# EAGLE design Power Monitor (EAGLE 7.7.0)
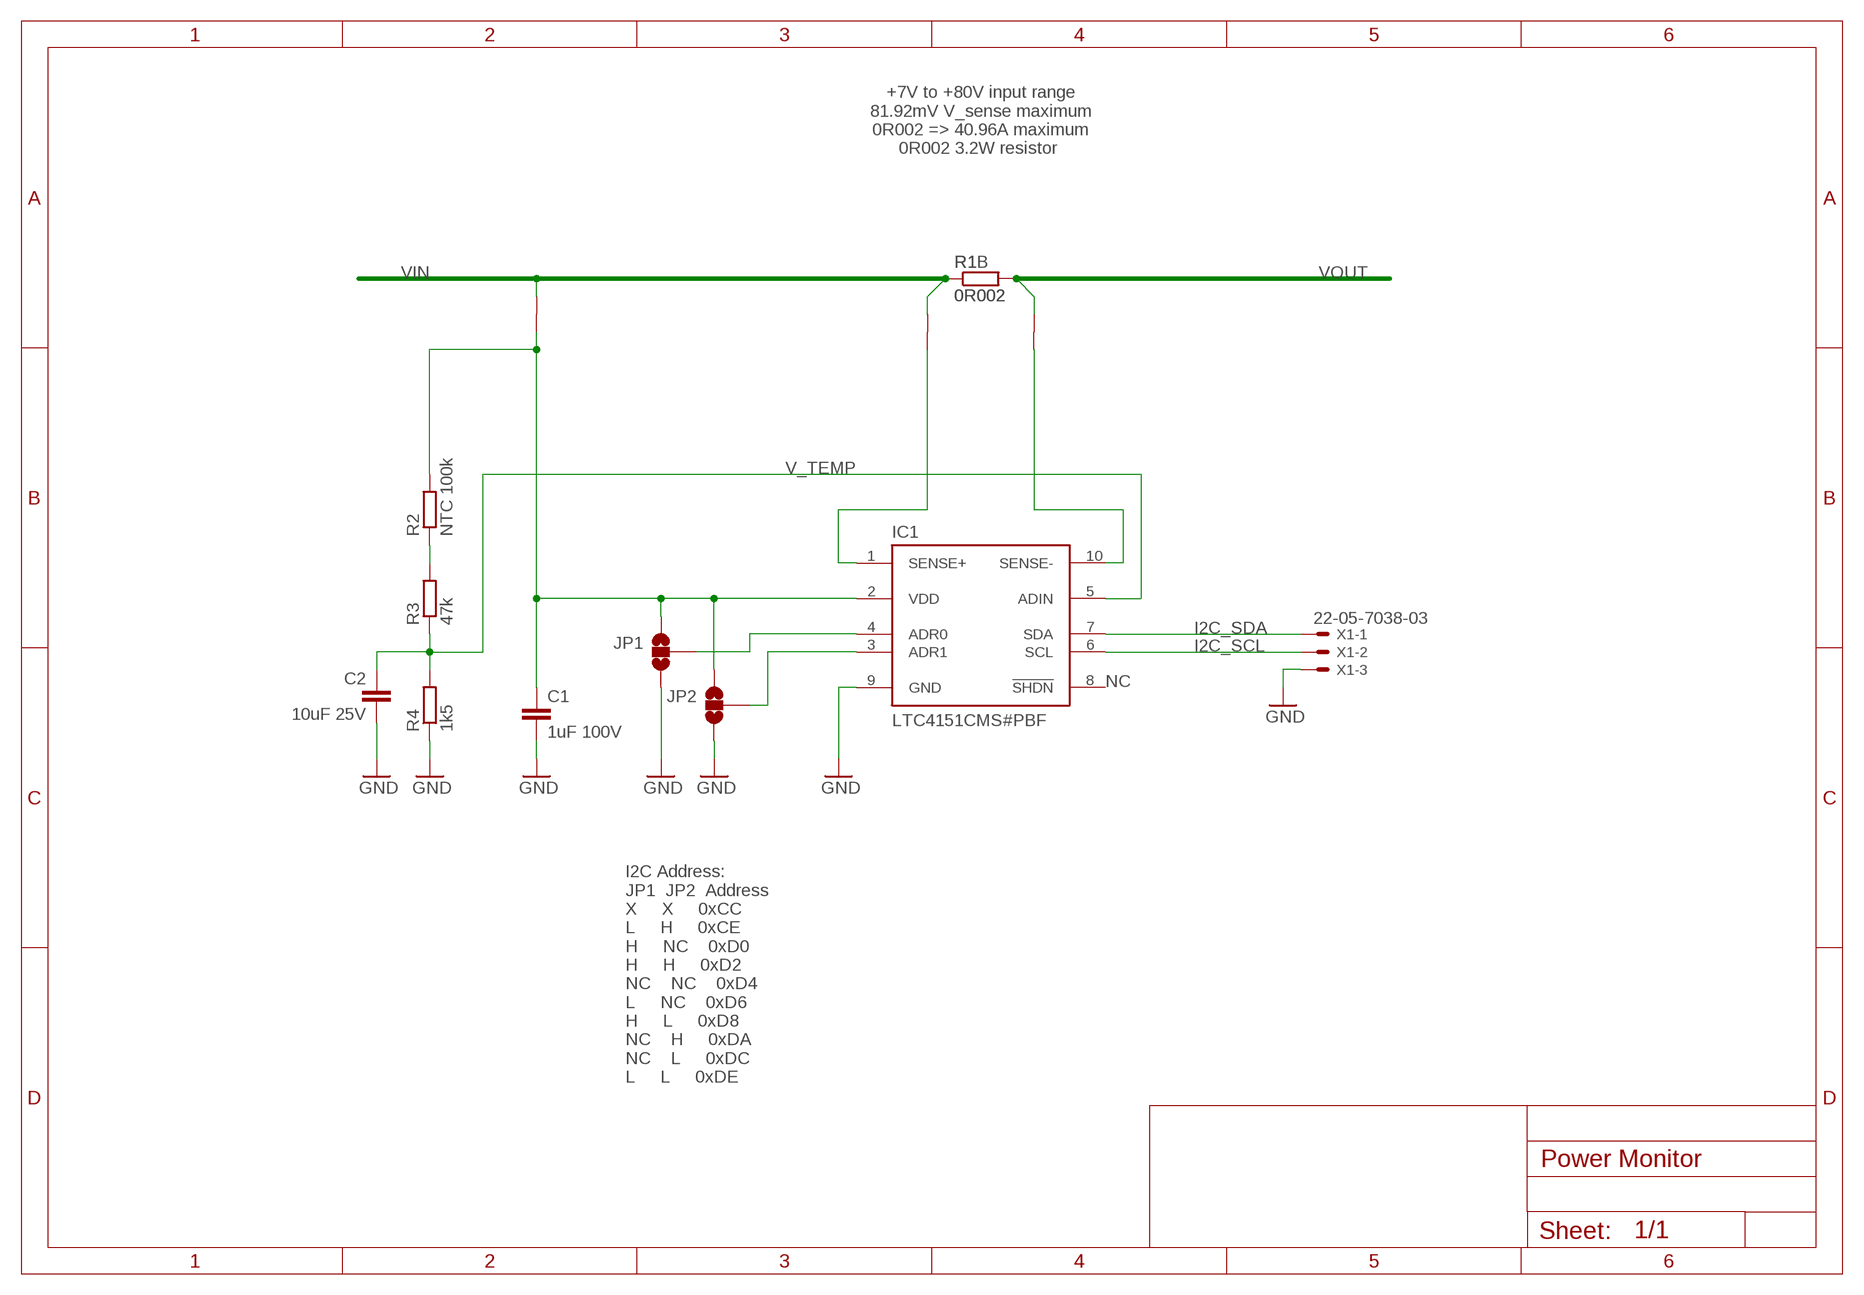
[diagram p0: schematic, sheet 1]

## Parts
C1  1uF 100V  C-EUC0603  [C0603]
C2  10uF 25V  C-EUC0603  [C0603]
IC1  LTC4151CMS#PBF  LTC4151?MS  [MSOP10]
JP1  JUMPER-SMT_3_NO_SILK  [SMT-JUMPER_3_NO_SILK]
JP2  JUMPER-SMT_3_NO_SILK  [SMT-JUMPER_3_NO_SILK]
R1  0R002  R-EU_R2512  [R2512]
R1B  0R002  R-EU_R2512  [R2512]
R2  NTC 100k  R-EU_R0603  [R0603]
R3  47k  R-EU_R0603  [R0603]
R4  1k5  R-EU_R0603  [R0603]
U$2  SHORT-002  [2X2]
U$3  SHORT-002  [2X2]
U$4  SHORT-002  [2X2]
X1  22-05-7038-03  [7395-03]

## Nets
GND: C1.2 C2.2 IC1.9(GND) JP1.3 JP2.3 R4.1 X1.3
I2C_SCL: IC1.6(SCL) X1.2
I2C_SDA: IC1.7(SDA) X1.1
N$1: IC1.4(ADR0) JP1.2
N$2: IC1.3(ADR1) JP2.2
N$4: R2.1 R3.2
SEN_N [low curr]: IC1.10(SENSE-) U$3.1
SEN_P [low curr]: IC1.1(SENSE+) U$2.1
V_TEMP: C2.1 IC1.5(ADIN) R3.1 R4.2
VDD [low curr]: C1.1 IC1.2(VDD) JP1.1 JP2.1 R2.2 U$4.1
VIN [high power]: R1.1 R1B.1 U$2.2 U$4.2
VOUT [high power]: R1.2 R1B.2 U$3.2
Unconnected: IC1.8(!SHDN!)

## Notes on the sheet
- +7V to +80V input range
  81.92mV V_sense maximum
  0R002 => 40.96A maximum
  0R002 3.2W resistor
- NC
- I2C Address:
  JP1  JP2  Address
  X     X     0xCC
  L     H     0xCE
  H     NC    0xD0
  H     H     0xD2
  NC    NC    0xD4
  L     NC    0xD6
  H     L     0xD8
  NC    H     0xDA
  NC    L     0xDC
  L     L     0xDE

## Library data of the parts
C1 C2 = rcl:C-EU: CAPACITOR, European symbol
IC1 = SparkFun-IC-Power:LTC4151
JP1 JP2 = SparkFun-Jumpers:JUMPER-SMT_3_NO: Normally open jumper This jumper has three pads in close proximity to each other. Apply solder to close the connection(s).
R1 R1B = rcl:R-EU_: RESISTOR, European symbol; FARNELL_OC: 2709404
R2-R4 = rcl:R-EU_: RESISTOR, European symbol
U$2-U$4 = shorts:SHORT
X1 = con-molex:22-?-03: CONNECTOR wire to board 2.54 mm (.1 inch) pitch header; OC_FARNELL: unknown; OC_NEWARK: unknown

## Net classes
0 default: width 0.254 mm, drill 0.33 mm
1 high power: width 8.382 mm, drill 0.33 mm, clearance 0.889 mm to class 0
2 low curr: width 0.254 mm, drill 0.33 mm

## Board
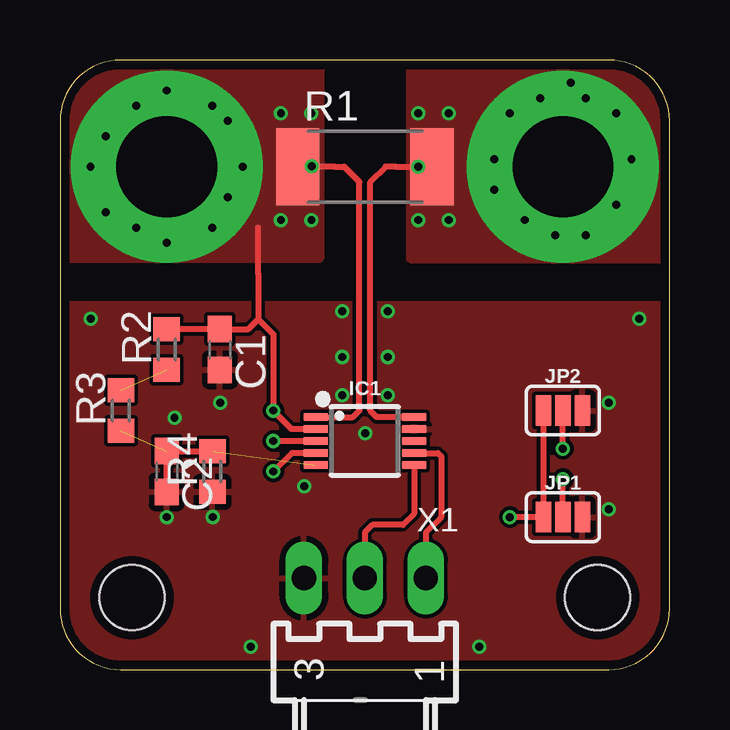
[diagram p1: board, top side]
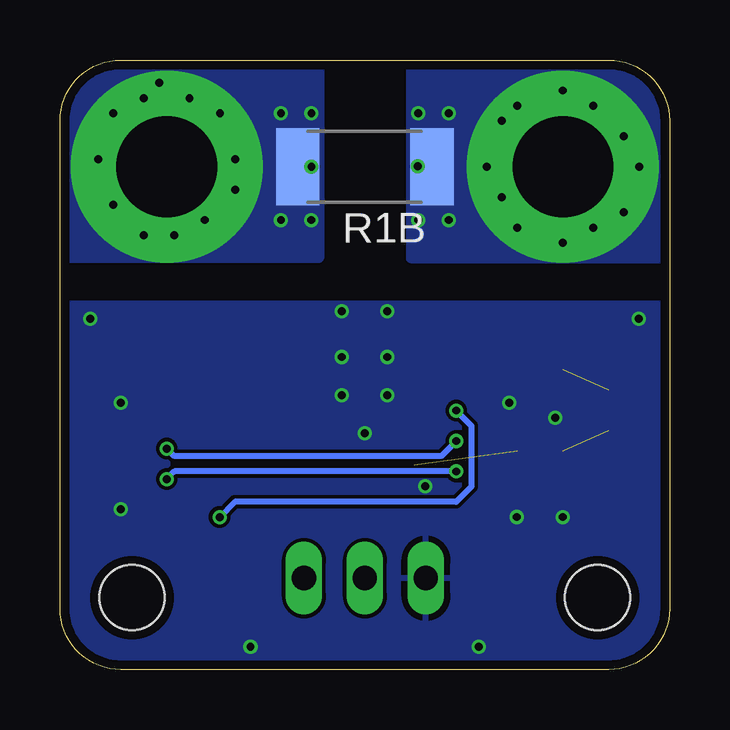
[diagram p2: board, bottom side, seen from below]

Size 25.4 x 25.4 mm. Coordinates in mm from the lower left corner, seen from the top.
Outline: 0,22.86 0,2.54 arc90 2.54,0 22.86,0 arc90 25.4,2.54 25.4,22.86 arc90 22.86,25.4 2.54,25.4 arc90 0,22.86
Copper layers (1*16): Top 0.035559375mm / dielectric 1.6mm / Bottom 0.035559375mm
Design rules "oshpark-2layer": minimum track width 6mil, minimum drill 10mil, track to track 6mil, track to pad 6mil, pad to pad 6mil, via to via 6mil, smd to smd 6mil, copper to edge 15mil, drill to drill 6mil, minimum pad ring 5mil, minimum via ring 5mil, stop-mask expansion 2.5mil, vias tented up to drill 15mil, thermal gap 10mil
Holes 2.7 mm at 3,3 22.4,3

### Footprints (pad centres in the part's own frame; a part is rotated, then mirrored left to right if it is on the bottom)
C0603 = smd 1.1 x 1: 1 -0.85,0; 2 0.85,0
MSOP10 = smd 0.3 x 1: 1 -1,-2.05; 2 -0.5,-2.05; 3 0,-2.05; 4 0.5,-2.05; 5 1,-2.05; 6 1,2.05; 7 0.5,2.05; 8 0,2.05; 9 -0.5,2.05; 10 -1,2.05
SMT-JUMPER_3_NO_SILK = smd 0.635 x 1.27: 1 -0.813,0; 2 0,0; 3 0.813,0
R2512 = smd 1.8 x 3.2: 1 -2.8,0; 2 2.8,0
R0603 = smd 1 x 1.1: 1 -0.85,0; 2 0.85,0
2X2 = smd 0.051 x 0.051: 1 0,0; 2 0,0
7395-03 = drill 1.016 long: 1 2.54,0; 2 0,0; 3 -2.54,0

### Placement (x,y rotation side)
C1  6.67,13.34 270 top
C2  4.45,8.26 270 top
IC1  12.7,9.53 270 top
JP1  20.95,6.35 0 top
JP2  20.95,10.79 0 top
R1  12.7,20.95 0 top
R1B  12.7,20.95 180 bottom
R2  4.44,13.33 90 top
R3  2.54,10.79 90 top
R4  6.35,8.26 90 top
U$2  11.43,20.95 0 top
U$3  13.97,20.95 0 top
U$4  8.26,16.51 0 top
X1  12.7,3.81 0 top

### Tracks (layer width: path | path; a pad name or v marks a point on that pad's centre or on a via)
GND  (via drill 0.33)
  other vias: 17.46,0.95 12.71,9.85 11.76,11.44 13.66,11.44 22.87,11.12 22.87,6.68 6.68,11.12 6.36,6.36 4.46,6.36 11.76,14.93 13.66,14.93 13.66,13.03 11.76,13.03 4.77,10.49 1.28,14.61 24.14,14.61 7.95,0.96 10.18,7.63
  pour Top (rank 5): 0,15.24 25.4,15.24 25.4,0 0,0
  pour Bottom (rank 5): 0,15.24 25.4,15.24 25.4,0 0,0
I2C_SCL
  Top 0.254: IC1.6 14.75,6.49 14.29,6.03 13.02,6.03 12.7,5.71 X1.2
I2C_SDA
  Top 0.254: IC1.7 15.74,9.03 15.88,8.89 15.88,6.35 15.24,5.71 X1.1
N$1  (via drill 0.33)
  Top 0.254: IC1.4 9.66,9.03 v8.89,8.26 | JP1.2 v20.95,7.94
  Bottom 0.254: v8.89,8.26 20.64,8.26 v20.95,7.94
N$2  (via drill 0.33)
  Top 0.254: IC1.3 v8.89,9.53 | v20.95,9.21 JP2.2
  Bottom 0.254: v8.89,9.53 9.53,8.89 20.64,8.89 v20.95,9.21
N$4  (1 unrouted)
SEN_N
  Top 0.254: IC1.10 13.2,10.53 12.93,10.79 12.93,20.32 13.56,20.95 U$3.1
SEN_P
  Top 0.254: IC1.1 12.2,10.53 12.47,10.79 12.47,20.32 11.84,20.95 U$2.1
V_TEMP  (2 unrouted)
  Top 0.254: 4.44,7.84 C2.1 R4.2
VDD  (via drill 0.33)
  Top 0.254: U$4.1 8.26,14.61 | IC1.2 9.66,10.03 v8.89,10.79 8.89,13.97 8.26,14.61 | R2.2 C1.1 7.84,14.19 8.26,14.61 | JP2.1 JP1.1 v18.75,6.36
  Bottom 0.254: v8.89,10.79 8.26,10.16 8.26,10.15 8.26,7.63 8.9,6.99 18.11,6.99 v18.75,6.36
VIN  (via drill 0.33, 4.2 pad 8)
  Top 0.254: U$4.2 8.26,18.41 | U$2.2 R1B.1
  other vias: 4.45,20.95 9.21,23.18 10.48,18.73 10.48,23.18 9.21,18.73 4.45,24.13 6.35,23.5 6.99,22.86 7.62,20.95 6.99,19.68 6.35,18.41 4.45,17.78 3.17,18.41 1.91,19.05 1.27,20.95 1.91,22.23 3.17,23.5 10.49,20.97
  pour Top (no thermals): 0,25.4 10.79,25.4 10.79,17.14 0,17.14
  pour Bottom (no thermals): 0,25.4 10.79,25.4 10.79,17.14 0,17.14
VOUT  (via drill 0.33, 4.2 pad 8)
  Top 0.254: U$3.2 R1B.2
  other vias: 20.95,20.95 16.19,18.73 16.19,23.18 14.92,23.18 14.92,18.73 18.1,21.27 23.81,21.27 21.27,24.45 21.91,23.81 23.18,23.18 20,23.81 18.73,23.18 18.1,20 19.37,18.73 20.64,18.1 21.91,18.1 23.18,19.37 14.92,20.95
  pour Bottom (no thermals): 14.61,25.4 14.61,17.14 25.4,17.14 25.4,25.4
  pour Top (no thermals): 14.61,25.4 14.61,17.14 25.4,17.14 25.4,25.4